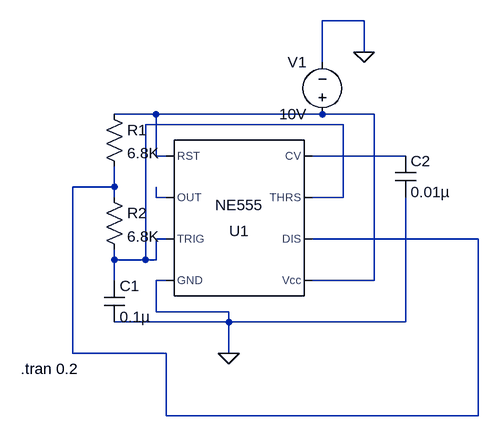
[diagram p0: schematic 555 Timer Astable Multivibrator.asc]
555 Timer Astable Multivibrator.asc, the LTspice schematic file:
Version 4
SHEET 1 880 680
WIRE 464 -240 400 -240
WIRE 464 -192 464 -240
WIRE 400 -176 400 -240
WIRE 144 -96 80 -96
WIRE 400 -96 144 -96
WIRE 480 -96 400 -96
WIRE 432 -80 128 -80
WIRE 144 -32 144 -96
WIRE 160 -32 144 -32
WIRE 528 -32 384 -32
WIRE 80 16 80 -16
WIRE 80 16 16 16
WIRE 80 32 80 16
WIRE 144 32 144 16
WIRE 160 32 144 32
WIRE 432 32 432 -80
WIRE 432 32 384 32
WIRE 160 96 144 96
WIRE 640 96 384 96
WIRE 80 128 80 112
WIRE 128 128 128 -80
WIRE 128 128 80 128
WIRE 144 128 144 96
WIRE 144 128 128 128
WIRE 80 160 80 128
WIRE 160 160 144 160
WIRE 480 160 480 -96
WIRE 480 160 384 160
WIRE 144 208 144 160
WIRE 256 208 144 208
WIRE 256 224 256 208
WIRE 256 224 80 224
WIRE 528 224 528 32
WIRE 528 224 256 224
WIRE 16 272 16 16
WIRE 160 272 16 272
WIRE 256 272 256 224
WIRE 160 368 160 272
WIRE 640 368 640 96
WIRE 640 368 160 368
FLAG 464 -192 0
FLAG 256 272 0
SYMBOL Misc\\NE555 272 64 M180
SYMATTR InstName U1
SYMBOL voltage 400 -80 R180
WINDOW 0 24 96 Left 2
WINDOW 3 24 16 Left 2
WINDOW 123 0 0 Left 0
WINDOW 39 0 0 Left 0
SYMATTR InstName V1
SYMATTR Value 10V
SYMBOL res 64 -112 R0
SYMATTR InstName R1
SYMATTR Value 6.8K
SYMBOL res 64 16 R0
SYMATTR InstName R2
SYMATTR Value 6.8K
SYMBOL cap 64 160 R0
SYMATTR InstName C1
SYMATTR Value 0.1µ
SYMBOL cap 512 -32 R0
SYMATTR InstName C2
SYMATTR Value 0.01µ
TEXT -64 296 Left 2 !.tran 0.2

The netlist it stands for:
* 555 Timer Astable Multivibrator.asc
XU1 0 N002 N005 N001 N003 N002 N004 N001 NE555  ; pins GND TRIG OUT RST CV THRS DIS Vcc
V1 N001 0 10V
R1 N001 N004 6.8K
R2 N004 N002 6.8K
C1 N002 0 0.1µ
C2 N003 0 0.01µ
.tran 0.2
.lib NE555.sub
.backanno
.end